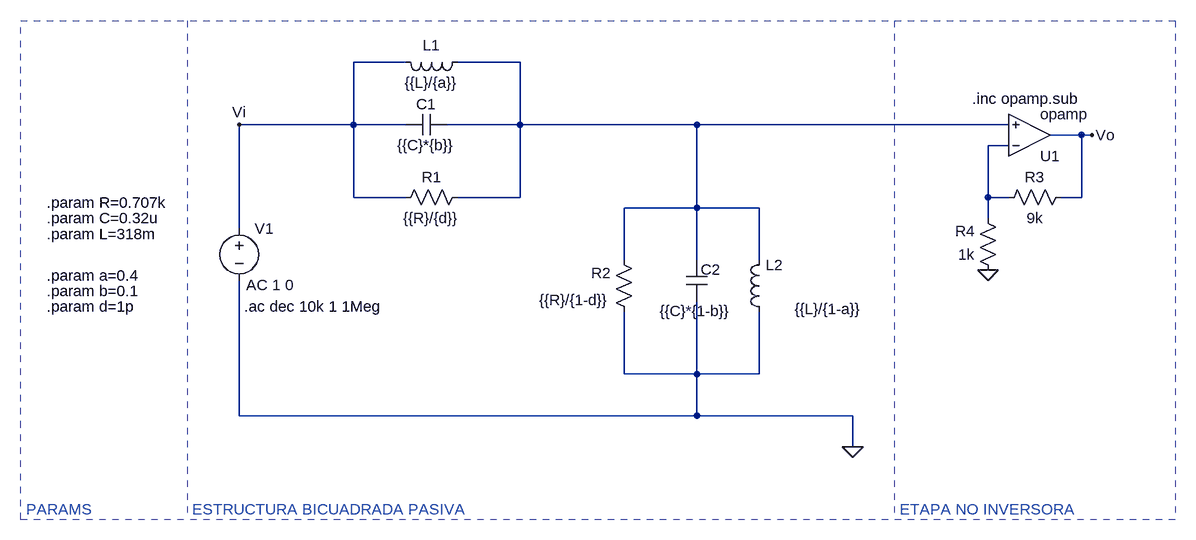
[diagram p0: schematic BicuadPasivo.asc]
BicuadPasivo.asc, the LTspice schematic file:
Version 4
SHEET 1 1408 680
WIRE 208 -96 128 -96
WIRE 384 -96 288 -96
WIRE 128 0 128 -96
WIRE 128 0 -48 0
WIRE 208 0 128 0
WIRE 384 0 384 -96
WIRE 384 0 272 0
WIRE 656 0 384 0
WIRE 1136 0 656 0
WIRE 1248 16 1200 16
WIRE 1264 16 1248 16
WIRE 1136 32 1104 32
WIRE 128 112 128 0
WIRE 208 112 128 112
WIRE 384 112 384 0
WIRE 384 112 288 112
WIRE 1104 112 1104 32
WIRE 1136 112 1104 112
WIRE 1248 112 1248 16
WIRE 1248 112 1216 112
WIRE 656 128 656 0
WIRE 656 128 544 128
WIRE 752 128 656 128
WIRE 1104 144 1104 112
WIRE -48 160 -48 0
WIRE 544 208 544 128
WIRE 656 208 656 128
WIRE 752 208 752 128
WIRE 544 384 544 288
WIRE 656 384 656 272
WIRE 656 384 544 384
WIRE 752 384 752 288
WIRE 752 384 656 384
WIRE -48 448 -48 240
WIRE 656 448 656 384
WIRE 656 448 -48 448
WIRE 896 448 656 448
WIRE 896 496 896 448
FLAG 896 496 0
FLAG 1264 16 Vo
FLAG -48 0 Vi
FLAG 1104 224 0
SYMBOL voltage -48 144 R0
WINDOW 123 11 103 Left 2
WINDOW 39 0 0 Left 0
SYMATTR Value2 AC 1 0
SYMATTR InstName V1
SYMATTR Value ""
SYMBOL res 304 96 R90
WINDOW 0 0 56 VBottom 2
WINDOW 3 32 56 VTop 2
SYMATTR InstName R1
SYMATTR Value {{R}/{d}}
SYMBOL ind 304 -112 R90
WINDOW 0 5 56 VBottom 2
WINDOW 3 32 56 VTop 2
SYMATTR InstName L1
SYMATTR Value {{L}/{a}}
SYMBOL cap 272 -16 R90
WINDOW 0 0 32 VBottom 2
WINDOW 3 32 32 VTop 2
SYMATTR InstName C1
SYMATTR Value {{C}*{b}}
SYMBOL res 560 304 R180
WINDOW 0 36 76 Left 2
WINDOW 3 38 34 Left 2
SYMATTR InstName R2
SYMATTR Value {{R}/{1-d}}
SYMBOL ind 768 304 R180
WINDOW 0 -21 88 Left 2
WINDOW 3 -144 20 Left 2
SYMATTR InstName L2
SYMATTR Value {{L}/{1-a}}
SYMBOL cap 672 272 R180
WINDOW 0 -21 49 Left 2
WINDOW 3 -38 -15 Left 2
SYMATTR InstName C2
SYMATTR Value {{C}*{1-b}}
SYMBOL OpAmps\\opamp 1168 80 M180
SYMATTR InstName U1
SYMBOL res 1232 96 R90
WINDOW 0 0 56 VBottom 2
WINDOW 3 32 56 VTop 2
SYMATTR InstName R3
SYMATTR Value 9k
SYMBOL res 1120 240 R180
WINDOW 0 36 76 Left 2
WINDOW 3 36 40 Left 2
SYMATTR InstName R4
SYMATTR Value 1k
TEXT -344 120 Left 2 !.param R=0.707k
TEXT -344 144 Left 2 !.param C=0.32u
TEXT -344 168 Left 2 !.param L=318m
TEXT -344 232 Left 2 !.param a=0.4
TEXT -344 256 Left 2 !.param b=0.1
TEXT -344 280 Left 2 !.param d=1p
TEXT -40 280 Left 2 !.ac dec 10k 1 1Meg
TEXT 1080 -40 Left 2 !.inc opamp.sub
TEXT -376 592 Left 2 ;PARAMS
TEXT -120 592 Left 2 ;ESTRUCTURA BICUADRADA PASIVA
TEXT 968 592 Left 2 ;ETAPA NO INVERSORA
LINE Normal -128 -160 -128 608 2
LINE Normal 960 -160 960 608 2
RECTANGLE Normal 1392 608 -384 -160 2

The netlist it stands for:
* BicuadPasivo.asc
V1 Vi 0 AC 1 0
R1 N001 Vi {{R}/{d}}
L1 N001 Vi {{L}/{a}}
C1 N001 Vi {{C}*{b}}
R2 0 N001 {{R}/{1-d}}
L2 0 N001 {{L}/{1-a}}
C2 0 N001 {{C}*{1-b}}
XU1 N002 N001 Vo opamp Aol=100K GBW=10Meg  ; pins invin noninvin out
R3 Vo N002 9k
R4 0 N002 1k
.param R=0.707k
.param C=0.32u
.param L=318m
.param a=0.4
.param b=0.1
.param d=1p
.ac dec 10k 1 1Meg
.inc opamp.sub
* PARAMS
* ESTRUCTURA BICUADRADA PASIVA
* ETAPA NO INVERSORA
.backanno
.end